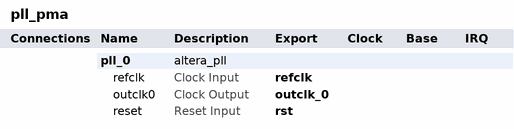
[diagram p0: system contents]
# Platform Designer (Qsys) system pll_pma, Stratix V 5SGXEA7N3F45C2
# Parameters at their usual value, and those the tool derives, are not listed.
package require -exact qsys 14.0
create_system pll_pma
set_project_property DEVICE_FAMILY {Stratix V}
set_project_property DEVICE 5SGXEA7N3F45C2

add_instance pll_0 altera_pll 14.0
set_instance_parameter_value pll_0 gui_device_speed_grade 1
set_instance_parameter_value pll_0 gui_pll_mode {Integer-N PLL}
set_instance_parameter_value pll_0 gui_reference_clock_frequency 257.8125
set_instance_parameter_value pll_0 gui_operation_mode direct
set_instance_parameter_value pll_0 gui_use_locked false
set_instance_parameter_value pll_0 gui_number_of_clocks 1
set_instance_parameter_value pll_0 gui_output_clock_frequency0 156.25

# exported interfaces
add_interface refclk clock sink
set_interface_property refclk EXPORT_OF pll_0.refclk
add_interface rst reset sink
set_interface_property rst EXPORT_OF pll_0.reset
add_interface outclk_0 clock source
set_interface_property outclk_0 EXPORT_OF pll_0.outclk0

set_interconnect_requirement {$system} qsys_mm.clockCrossingAdapter HANDSHAKE
set_interconnect_requirement {$system} qsys_mm.maxAdditionalLatency 1
set_interconnect_requirement {$system} qsys_mm.insertDefaultSlave FALSE

save_system pll_pma.qsys
